# Altium schematic sheet 06_CapTouch.SchDoc: ECE315 Analog
size A; Date: 4/25/2017; ApprovedBy: JSK; CheckedBy: JSK; Author: JSK; CompanyName: University of Wisconsin; DrawnBy: JSK; Engineer: JSK; Organization: ECE 315; Address1: College of Engineering; Address2: 1415 Engineering Drive; Address3: Madison, WI 53706; Address4: ECE 315 Fall 2017; Revision: A; SheetNumber: 2; SheetTotal: 2; AssemblyNumber: EMG001; ApprovedDate: 4/25/2017
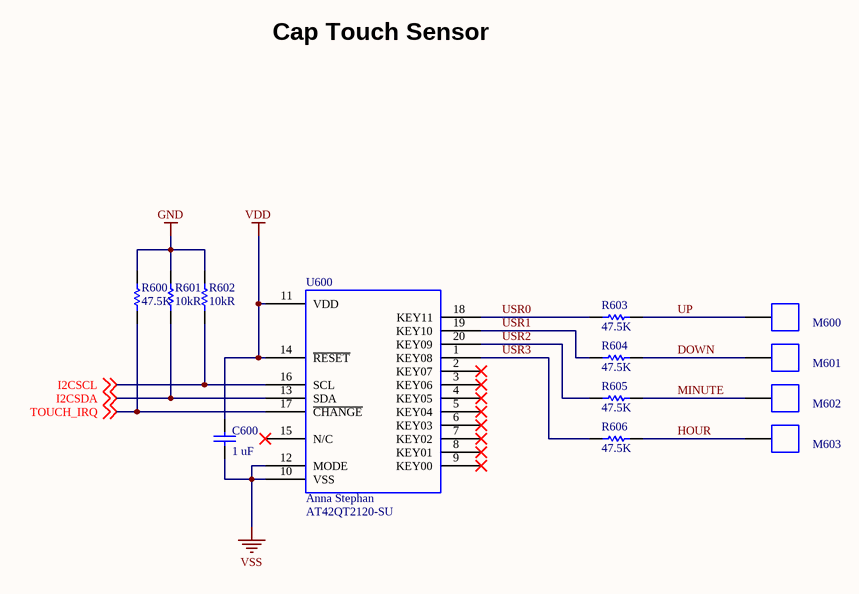
[diagram p0: 06_CapTouch.SchDoc]

## Parts
C600  Capacitance: 1 uF  [CAP_0805]  (hidden comment: CAP_0805_U_001.00)
M600  Mech_TouchPad  [TouchPad]  (value not drawn)  (no BOM)
M601  Mech_TouchPad  [TouchPad]  (value not drawn)  (no BOM)
M602  Mech_TouchPad  [TouchPad]  (value not drawn)  (no BOM)
M603  Mech_TouchPad  [TouchPad]  (value not drawn)  (no BOM)
R600  47.5K  [RES_0805]
R601  Resistance: 10kR  [RES_0805]  (hidden comment: RES_0805_K_010.00)
R602  Resistance: 10kR  [RES_0805]  (hidden comment: RES_0805_K_010.00)
R603  47.5K  [RES_0805]
R604  47.5K  [RES_0805]
R605  47.5K  [RES_0805]
R606  47.5K  [RES_0805]
U600  Drawn_By: Anna Stephan  Manufacturer Part Number 1: AT42QT2120-SU  [AT42QT2120-SOIC]  (hidden comment: IC_AT42QT2120)

## Nets
GND: R600.2 R601.2 R602.2
VDD: C600.1 U600.11(VDD) U600.14(~{RESET})
VSS: C600.2 U600.10(VSS) U600.12(MODE)
DOWN: M601.1 R604.1
HOUR: M603.1 R606.1
I2CSCL: R602.1 U600.16(SCL) ; off-sheet I2CSCL
I2CSDA: R601.1 U600.13(SDA) ; off-sheet I2CSDA
MINUTE: M602.1 R605.1
TOUCH_IRQ: R600.1 U600.17(~{CHANGE}) ; off-sheet TOUCH_IRQ
UP: M600.1 R603.1
USR0: R603.2 U600.18(KEY11)
USR1: R604.2 U600.19(KEY10)
USR2: R605.2 U600.20(KEY09)
USR3: R606.2 U600.1(KEY08)

Not connected (* = marked no-connect by the designer): U600 2(KEY07)* 3(KEY06)* 4(KEY05)* 5(KEY04)* 6(KEY03)* 7(KEY02)* 8(KEY01)* 9(KEY00)* 15(N/C)*

## Notes on the sheet
- Cap Touch Sensor

## Library data of the parts
C600 = CAP_0805_U_001.00: CAP CER 1UF 16V 10% X7R 0805; Manufacturer: Kemet; Manufacturer Part Number: C0805C105K4RACTU; Part # Aliases: C0805C105K4RAC7800; Capacitance - nF: 1000 nF; Case Height: 0.9 mm; Case Length: 2 mm; Case Width: 1.2 mm; Class: Class 1; Dissipation Factor DF: 5; Temperature Coefficient / Code: +/- 15 %; Type: SMD MLCC X7R 6.3 - 250 VDC Commerical Grade; Tolerance: 10 %; Supplier 1: Digikey; Supplier Part Number 1: 399-1284-1-ND; Stock 1: 692931; Pricing 1: 1=0.12, 10=0.087, 100=0.0407, 500=0.0286, 1000=0.0236 (USD); Brand: Kemet; Case Code - in: 0805; Case Code - mm: 2012; Dimensions: 1.2 mm W x 2 mm L x 0.9 mm H; Dielectric: X7R; Lead Spacing: 0.75 mm; Factory Pack Quantity: 2500; Voltage Rating: 16 V; Product Category: Multilayer Ceramic Capacitors MLCC - SMD/SMT; RoHS: Details; Minimum Operating Temperature: - 55 C; Maximum Operating Temperature: + 125 C; Product: General Type MLCCs; Operating Temperature Range: - 55 C to + 125 C; Package / Case: 0805 (2012 metric); Packaging: Reel; Series: C0805C; Termination Style: SMD/SMT; Voltage Rating DC: 16 V; ComponentLink1URL: https://datasheet.ciiva.com/14585/70095383-14585511.pdf; ComponentLink1Description: https://datasheet.ciiva.com/14585/70095383-14585511.pdf; ComponentLink2URL: https://datasheet.ciiva.com/6074/1722731-6074364.pdf; ComponentLink2Description: https://datasheet.ciiva.com/6074/1722731-6074364.pdf; ComponentLink3URL: https://datasheet.ciiva.com/14603/70095383-14603388.pdf; ComponentLink3Description: https://datasheet.ciiva.com/14603/70095383-14603388.pdf; ComponentLink4URL: https://datasheet.ciiva.com/28692/1851736-28692942.pdf; ComponentLink4Description: https://datasheet.ciiva.com/28692/1851736-28692942.pdf; ComponentLink5URL: https://datasheet.ciiva.com/39122/docfinderpartnumberc0402c102k5ractu-39122926.pdf; ComponentLink5Description: https://datasheet.ciiva.com/39122/docfinderpartnumberc0402c102k5ractu-39122926.pdf
M600-M603 = Mech_TouchPad: Capacative Touch Sensor Pad
R600 R603-R606 = RES_0805_K_047.50: Res Thick Film 2.0 x 1.2 mm 47.5K Ohm 1% 0.125W(1/8W) 100ppm/ C Molded SMD Paper T/R; Manufacturer 1: Yageo; Manufacturer Part Number 1: RC0805FR-0747K5L; Power Rating: 125mW; Voltage Rating: 150V; Temperature Coefficient: 100ppm/°C; Supplier 1: Digi-Key; Supplier Part Number 1: 311-47.5KCRCT-ND; RoHS: Yes; Category: Chip SMD Resistors; Stock 1: 246219; Pricing 1: 1=0.10000, 10=0.04200, 100=0.01690, 1000=0.00759, 2500=0.00659 (USD); Mount: Surface Mount; Case/Package: 0805; Case Code (Metric): 2012; Case Code (Imperial): 0805; Size Code: 0805; Min Operating Temperature: -55°C; Max Operating Temperature: 155°C; Tolerance: 1%; Package Quantity: 1; Packaging: Tape and Reel; Resistor Type: Thick Film; Number of Terminations: 2; Termination: SMD/SMT; Max Power Dissipation: 125mW; Voltage Rating (DC): 150V; Features: Moisture Resistant; Series: RC; Technology: THICK FILM; Length: 0.079inch; Width: 0.049inch; Height: 0.024inch; Depth: 1.25mm; Lead Free: Lead Free; RoHS Compliant: Yes; ComponentLink3URL: https://datasheet.ciiva.com/12667/rc0805-12667415.pdf?src-supplier=Mouser; ComponentLink3Description: https://datasheet.ciiva.com/12667/rc0805-12667415.pdf?src-supplier=Mouser; Resistance: 47.5K
R601 R602 = RES_0805_K_010.00: RES SMD 10K OHM 1% 1/8W 0805; Manufacturer 1: Yageo; Manufacturer Part Number 1: RC0805FR-0710KL; Temperature Coefficient: 100ppm/°C; Power Rating: 125mW; Voltage Rating: 150V; Supplier 1: Digi-Key; Supplier Part Number 1: 311-10.0KCRCT-ND; Stock 1: 7562122; Pricing 1: 1=0.10000, 10=0.04200, 100=0.01690, 1000=0.00759, 2500=0.00659 (USD); RoHS: Yes; Case/Package: 0805; Case Code (Imperial): 0805; Case Code (Metric): 2012; Min Operating Temperature: -55°C; Max Operating Temperature: 155°C; Tolerance: 1%; Packaging: Tape and Reel; Features: Moisture Resistant; Termination: SMD/SMT; Number of Terminations: 2; Military Standard: Not; Max Power Dissipation: 125mW; Package Quantity: 1; Length: 2mm; Height: 0.024inch; Width: 0.049inch; Depth: 1.25mm; Lead Free: Lead Free; REACH SVHC: Unknown; ComponentLink1URL: https://datasheet.ciiva.com/11808/0900766b8106beab-11808151.pdf?src-supplier=RSComponents; ComponentLink1Description: https://datasheet.ciiva.com/11808/0900766b8106beab-11808151.pdf?src-supplier=RSComponents; ComponentLink2URL: https://datasheet.ciiva.com/12669/rc0805-12669688.pdf?src-supplier=Mouser; ComponentLink2Description: https://datasheet.ciiva.com/12669/rc0805-12669688.pdf?src-supplier=Mouser; ComponentLink3URL: https://datasheet.ciiva.com/46447/444164-46447563.pdf?src-supplier=Element14; ComponentLink3Description: https://datasheet.ciiva.com/46447/444164-46447563.pdf?src-supplier=Element14; ComponentLink4URL: https://datasheet.ciiva.com/2456/pyu-r-int-thick-7-2456972.pdf?src-supplier=Digi-Key; ComponentLink4Description: https://datasheet.ciiva.com/2456/pyu-r-int-thick-7-2456972.pdf?src-supplier=Digi-Key; ComponentLink5URL: https://datasheet.ciiva.com/2456/pyu-r-int-thick-7-2456973.pdf?src-supplier=Digi-Key; ComponentLink5Description: https://datasheet.ciiva.com/2456/pyu-r-int-thick-7-2456973.pdf?src-supplier=Digi-Key; ComponentLink6URL: https://datasheet.ciiva.com/2456/pyu-r-int-thick-7-2456974.pdf?src-supplier=Digi-Key; ComponentLink6Description: https://datasheet.ciiva.com/2456/pyu-r-int-thick-7-2456974.pdf?src-supplier=Digi-Key; ComponentLink7URL: https://datasheet.ciiva.com/16747/rc0805-16747087.pdf?src-supplier=Future+Electronics; ComponentLink7Description: https://datasheet.ciiva.com/16747/rc0805-16747087.pdf?src-supplier=Future+Electronics; Category: Chip SMD Resistors; Size Code: 0805; Resistor Type: Thick Film; Series: RC; Construction: Rectangular; Resistance Tolerance: 1%; Technology: THICK FILM; RoHS Compliant: Yes
U600 = AT42QT2120: IC TOUCH SENSOR 12CH 20SOIC; Manufacturer 1: Microchip / Atmel; Interface: I2C; ComponentLink1URL: http://www.atmel.com/images/doc9634.pdf; ComponentLink1Description: http://www.atmel.com/images/doc9634.pdf; Supplier 1: Digi-Key; Supplier Part Number 1: AT42QT2120-SU-ND; RoHS: Yes; Category: Uncategorized; Stock 1: 417; Pricing 1: 1=1.31000, 25=1.21000, 100=1.09200 (USD); Case/Package: SOIC; Min Operating Temperature: -40°C; Max Operating Temperature: 85°C; Packaging: Rail/Tube; Package Quantity: 37; Series: QTouch™; RoHS Compliant: Yes; ComponentLink2URL: https://datasheet.ciiva.com/6483/doc9634-6483479.pdf?src-supplier=Digi-Key; ComponentLink2Description: https://datasheet.ciiva.com/6483/doc9634-6483479.pdf?src-supplier=Digi-Key; ComponentLink3URL: https://datasheet.ciiva.com/12177/doc9634-271534-12177086.pdf?src-supplier=Mouser; ComponentLink3Description: https://datasheet.ciiva.com/12177/doc9634-271534-12177086.pdf?src-supplier=Mouser